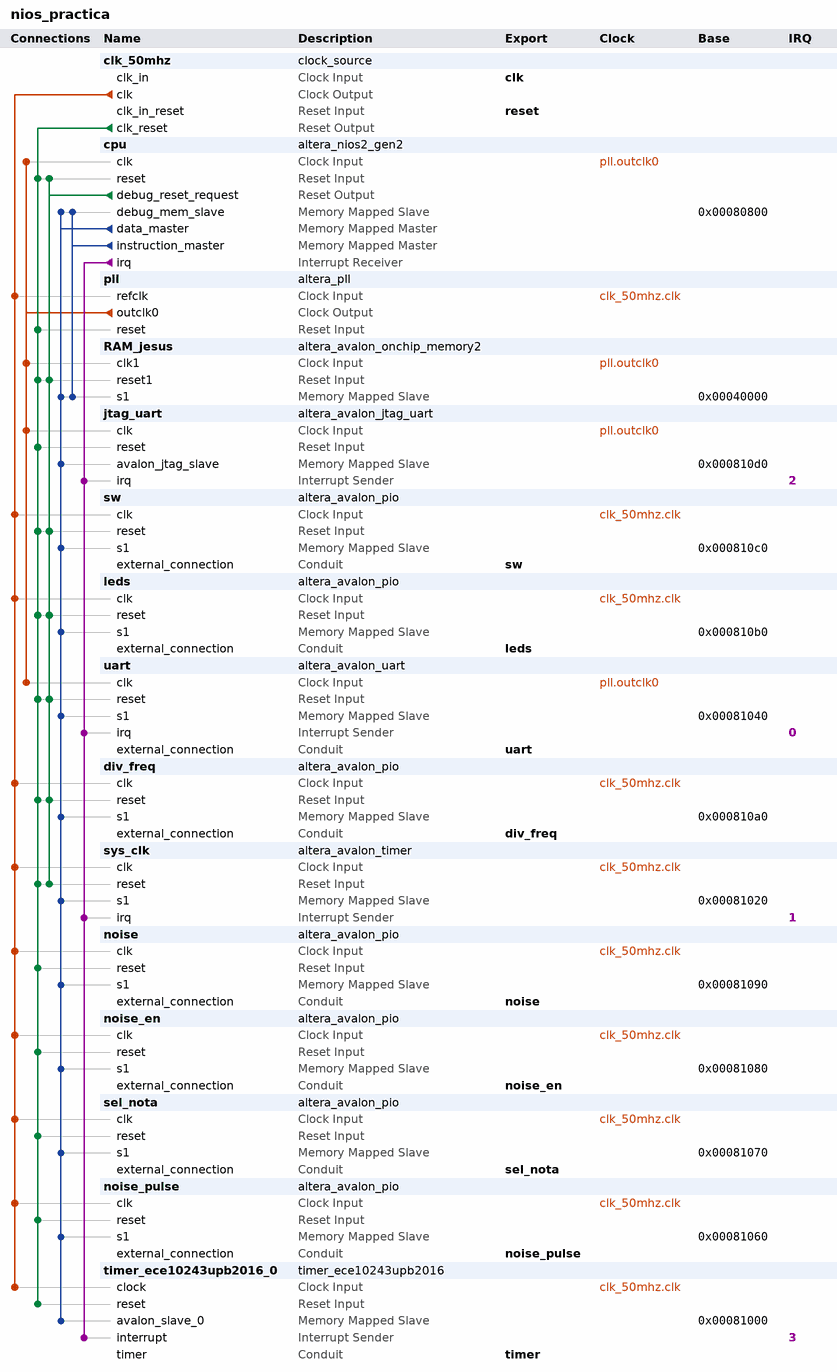
[diagram p0: system contents]
# Platform Designer (Qsys) system nios_practica, Cyclone V 5CSEMA4U23C6
# Parameters at their usual value, and those the tool derives, are not listed.
package require -exact qsys 15.0
create_system nios_practica
set_project_property DEVICE_FAMILY {Cyclone V}
set_project_property DEVICE 5CSEMA4U23C6

add_instance clk_50mhz clock_source 15.0
set_instance_parameter_value clk_50mhz clockFrequency 50000000

add_instance cpu altera_nios2_gen2 15.0
set_instance_parameter_value cpu dcache_size 2048
set_instance_parameter_value cpu exceptionSlave RAM_jesus.s1
set_instance_parameter_value cpu icache_size 4096
set_instance_parameter_value cpu impl Tiny
set_instance_parameter_value cpu resetSlave RAM_jesus.s1

add_instance pll altera_pll 15.0
set_instance_parameter_value pll gui_device_speed_grade 1
set_instance_parameter_value pll gui_number_of_clocks 1
set_instance_parameter_value pll gui_operation_mode direct
set_instance_parameter_value pll gui_output_clock_frequency0 150.0
set_instance_parameter_value pll gui_pll_mode {Integer-N PLL}
set_instance_parameter_value pll gui_reference_clock_frequency 50.0
set_instance_parameter_value pll gui_use_locked true

add_instance RAM_jesus altera_avalon_onchip_memory2 15.0
set_instance_parameter_value RAM_jesus dataWidth 32
set_instance_parameter_value RAM_jesus dualPort false
set_instance_parameter_value RAM_jesus initMemContent true
set_instance_parameter_value RAM_jesus initializationFileName onchip_mem.hex
set_instance_parameter_value RAM_jesus memorySize 220000

add_instance jtag_uart altera_avalon_jtag_uart 15.0
set_instance_parameter_value jtag_uart simInteractiveOptions NO_INTERACTIVE_WINDOWS

add_instance sw altera_avalon_pio 15.0
set_instance_parameter_value sw direction Input
set_instance_parameter_value sw width 4

add_instance leds altera_avalon_pio 15.0
set_instance_parameter_value leds direction Output
set_instance_parameter_value leds width 8

add_instance uart altera_avalon_uart 15.0
set_instance_parameter_value uart baud 115200
set_instance_parameter_value uart dataBits 8
set_instance_parameter_value uart fixedBaud false
set_instance_parameter_value uart parity NONE
set_instance_parameter_value uart stopBits 1

add_instance div_freq altera_avalon_pio 15.0
set_instance_parameter_value div_freq direction Output
set_instance_parameter_value div_freq width 32

add_instance sys_clk altera_avalon_timer 15.0
set_instance_parameter_value sys_clk period 1
set_instance_parameter_value sys_clk periodUnits MSEC

add_instance noise altera_avalon_pio 15.0
set_instance_parameter_value noise direction Output
set_instance_parameter_value noise width 16

add_instance noise_en altera_avalon_pio 15.0
set_instance_parameter_value noise_en direction Output
set_instance_parameter_value noise_en width 1

add_instance sel_nota altera_avalon_pio 15.0
set_instance_parameter_value sel_nota direction Output
set_instance_parameter_value sel_nota width 10

add_instance noise_pulse altera_avalon_pio 15.0
set_instance_parameter_value noise_pulse direction Output
set_instance_parameter_value noise_pulse width 1

add_instance timer_ece10243upb2016_0 timer_ece10243upb2016 1.0

# connections
add_connection clk_50mhz.clk div_freq.clk clock
add_connection clk_50mhz.clk leds.clk clock
add_connection clk_50mhz.clk noise.clk clock
add_connection clk_50mhz.clk noise_en.clk clock
add_connection clk_50mhz.clk noise_pulse.clk clock
add_connection clk_50mhz.clk pll.refclk clock
add_connection clk_50mhz.clk sel_nota.clk clock
add_connection clk_50mhz.clk sw.clk clock
add_connection clk_50mhz.clk sys_clk.clk clock
add_connection clk_50mhz.clk timer_ece10243upb2016_0.clock clock
add_connection pll.outclk0 cpu.clk clock
add_connection pll.outclk0 jtag_uart.clk clock
add_connection pll.outclk0 RAM_jesus.clk1 clock
add_connection pll.outclk0 uart.clk clock
add_connection clk_50mhz.clk_reset cpu.reset reset
add_connection clk_50mhz.clk_reset div_freq.reset reset
add_connection clk_50mhz.clk_reset jtag_uart.reset reset
add_connection clk_50mhz.clk_reset leds.reset reset
add_connection clk_50mhz.clk_reset noise.reset reset
add_connection clk_50mhz.clk_reset noise_en.reset reset
add_connection clk_50mhz.clk_reset noise_pulse.reset reset
add_connection clk_50mhz.clk_reset pll.reset reset
add_connection clk_50mhz.clk_reset RAM_jesus.reset1 reset
add_connection clk_50mhz.clk_reset sel_nota.reset reset
add_connection clk_50mhz.clk_reset sw.reset reset
add_connection clk_50mhz.clk_reset sys_clk.reset reset
add_connection clk_50mhz.clk_reset timer_ece10243upb2016_0.reset reset
add_connection clk_50mhz.clk_reset uart.reset reset
add_connection cpu.debug_reset_request cpu.reset reset
add_connection cpu.debug_reset_request div_freq.reset reset
add_connection cpu.debug_reset_request leds.reset reset
add_connection cpu.debug_reset_request RAM_jesus.reset1 reset
add_connection cpu.debug_reset_request sw.reset reset
add_connection cpu.debug_reset_request sys_clk.reset reset
add_connection cpu.debug_reset_request uart.reset reset
add_connection cpu.data_master cpu.debug_mem_slave avalon
set_connection_parameter_value cpu.data_master/cpu.debug_mem_slave baseAddress 0x00080800
add_connection cpu.data_master div_freq.s1 avalon
set_connection_parameter_value cpu.data_master/div_freq.s1 baseAddress 0x000810a0
add_connection cpu.data_master jtag_uart.avalon_jtag_slave avalon
set_connection_parameter_value cpu.data_master/jtag_uart.avalon_jtag_slave baseAddress 0x000810d0
add_connection cpu.data_master leds.s1 avalon
set_connection_parameter_value cpu.data_master/leds.s1 baseAddress 0x000810b0
add_connection cpu.data_master noise.s1 avalon
set_connection_parameter_value cpu.data_master/noise.s1 baseAddress 0x00081090
add_connection cpu.data_master noise_en.s1 avalon
set_connection_parameter_value cpu.data_master/noise_en.s1 baseAddress 0x00081080
add_connection cpu.data_master noise_pulse.s1 avalon
set_connection_parameter_value cpu.data_master/noise_pulse.s1 baseAddress 0x00081060
add_connection cpu.data_master RAM_jesus.s1 avalon
set_connection_parameter_value cpu.data_master/RAM_jesus.s1 baseAddress 0x00040000
add_connection cpu.data_master sel_nota.s1 avalon
set_connection_parameter_value cpu.data_master/sel_nota.s1 baseAddress 0x00081070
add_connection cpu.data_master sw.s1 avalon
set_connection_parameter_value cpu.data_master/sw.s1 baseAddress 0x000810c0
add_connection cpu.data_master sys_clk.s1 avalon
set_connection_parameter_value cpu.data_master/sys_clk.s1 baseAddress 0x00081020
add_connection cpu.data_master timer_ece10243upb2016_0.avalon_slave_0 avalon
set_connection_parameter_value cpu.data_master/timer_ece10243upb2016_0.avalon_slave_0 baseAddress 0x00081000
add_connection cpu.data_master uart.s1 avalon
set_connection_parameter_value cpu.data_master/uart.s1 baseAddress 0x00081040
add_connection cpu.instruction_master cpu.debug_mem_slave avalon
set_connection_parameter_value cpu.instruction_master/cpu.debug_mem_slave baseAddress 0x00080800
add_connection cpu.instruction_master RAM_jesus.s1 avalon
set_connection_parameter_value cpu.instruction_master/RAM_jesus.s1 baseAddress 0x00040000
add_connection cpu.irq jtag_uart.irq interrupt
set_connection_parameter_value cpu.irq/jtag_uart.irq irqNumber 2
add_connection cpu.irq sys_clk.irq interrupt
set_connection_parameter_value cpu.irq/sys_clk.irq irqNumber 1
add_connection cpu.irq timer_ece10243upb2016_0.interrupt interrupt
set_connection_parameter_value cpu.irq/timer_ece10243upb2016_0.interrupt irqNumber 3
add_connection cpu.irq uart.irq interrupt
set_connection_parameter_value cpu.irq/uart.irq irqNumber 0

# exported interfaces
add_interface clk clock sink
set_interface_property clk EXPORT_OF clk_50mhz.clk_in
add_interface div_freq conduit end
set_interface_property div_freq EXPORT_OF div_freq.external_connection
add_interface leds conduit end
set_interface_property leds EXPORT_OF leds.external_connection
add_interface noise conduit end
set_interface_property noise EXPORT_OF noise.external_connection
add_interface noise_en conduit end
set_interface_property noise_en EXPORT_OF noise_en.external_connection
add_interface noise_pulse conduit end
set_interface_property noise_pulse EXPORT_OF noise_pulse.external_connection
add_interface reset reset sink
set_interface_property reset EXPORT_OF clk_50mhz.clk_in_reset
add_interface sel_nota conduit end
set_interface_property sel_nota EXPORT_OF sel_nota.external_connection
add_interface sw conduit end
set_interface_property sw EXPORT_OF sw.external_connection
add_interface timer conduit end
set_interface_property timer EXPORT_OF timer_ece10243upb2016_0.timer
add_interface uart conduit end
set_interface_property uart EXPORT_OF uart.external_connection

set_interconnect_requirement {$system} qsys_mm.clockCrossingAdapter HANDSHAKE
set_interconnect_requirement {$system} qsys_mm.enableEccProtection FALSE
set_interconnect_requirement {$system} qsys_mm.insertDefaultSlave FALSE
set_interconnect_requirement {$system} qsys_mm.maxAdditionalLatency 1

save_system nios_practica.qsys
